# Altium project UltraZohm_ADC.PrjPCB (part 3 of 3)
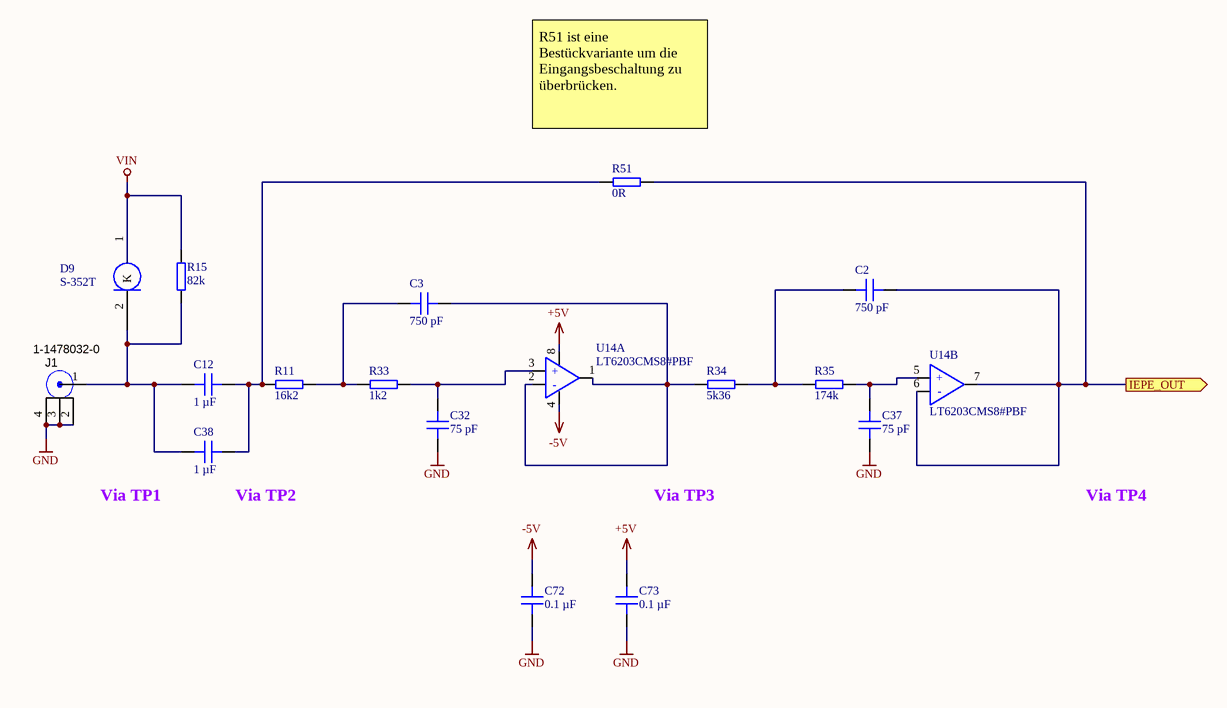
[diagram p10: IEPE.SchDoc]

## Nets that join several sheets
6.5V: Power_3 (L6.1 L8.1 L10.1 L11.1), Power_1 (9 pins)
+1.8V: CarrierConnector (C1.2 U1.2 U1.6), Power_3 (5 pins)
+2.5V: OpAmp1 (R40A.2), OpAmp2 (R40B.2), OpAmp3 (R40C.2), OpAmp4 (R40D.2), ADC1 (C7A.2 U4A.10 U4A.12), ADC2 (C7B.2 U4B.10 U4B.12), ADC3 (C7C.2 U4C.10 U4C.12), ADC4 (C7D.2 U4D.10 U4D.12), Power_3 (C58.2 C59.2 L17.2 R36.2)
+3.3V: OpAmp1 (7 pins), OpAmp2 (7 pins), OpAmp3 (7 pins), OpAmp4 (7 pins), Power_3 (C42.2 C46.2 L9.2 R30.2), I2C (8 pins)
+5V: OpAmp1 (R23A.2), OpAmp2 (R23B.2), OpAmp3 (R23C.2), OpAmp4 (R23D.2), ADC1 (C5A.2 C6A.2 U4A.4), ADC2 (C5B.2 C6B.2 U4B.4), ADC3 (C5C.2 C6C.2 U4C.4), ADC4 (C5D.2 C6D.2 U4D.4), Power_3 (C31.2 C36.2 L7.2 R29.2), IEPE1 (C73A.2 U14A.8), IEPE2 (C73B.2 U14B.8), IEPE3 (C73C.2 U14C.8), IEPE4 (C73D.2 U14D.8)
-5V: Power_2 (5 pins), IEPE1 (C72A.2 U14A.4), IEPE2 (C72B.2 U14B.4), IEPE3 (C72C.2 U14C.4), IEPE4 (C72D.2 U14D.4)
-24V: Power_2 (L4.1 L18.1), Power_1 (14 pins)
GND: CarrierConnector (33 pins), OpAmp1 (15 pins), OpAmp2 (15 pins), OpAmp3 (15 pins), OpAmp4 (15 pins), ADC1 (13 pins), ADC2 (13 pins), ADC3 (13 pins), ADC4 (13 pins), Power_2 (30 pins), Power_3 (34 pins), ADC_Ref (6 pins), I2C (6 pins), Power_1 (23 pins), IEPE1 (7 pins), IEPE2 (7 pins), IEPE3 (7 pins), IEPE4 (7 pins)
VCC: OpAmp1 (R18A.2), OpAmp2 (R18B.2), OpAmp3 (R18C.2), OpAmp4 (R18D.2), Power_2 (C21.2 C22.2 L3.2 TP31.1), ADC_Ref (R31.1)
VCC-: OpAmp1 (R19A.2), OpAmp2 (R19B.2), OpAmp3 (R19C.2), OpAmp4 (R19D.2), Power_2 (C28.2 C29.2 L5.2 TP32.1)
VIN: CarrierConnector (X1.5 X1.6), ADC_Ref (R32.1), Power_1 (L12.1 L13.1 R63.2), IEPE1 (D9A.1 R15A.2), IEPE2 (D9B.1 R15B.2), IEPE3 (D9C.1 R15C.2), IEPE4 (D9D.1 R15D.2)
VREF: ADC1 (L1A.2), ADC2 (L1B.2), ADC3 (L1C.2), ADC4 (L1D.2), ADC_Ref (C70.2 C71.2 TP27.1 U12.6)
ADC_OUT_N1: CarrierConnector (X1.43), ADC1 (U4A.13)
ADC_OUT_N2: CarrierConnector (X1.37), ADC2 (U4B.13)
ADC_OUT_N3: CarrierConnector (X1.31), ADC3 (U4C.13)
ADC_OUT_N4: CarrierConnector (X1.25), ADC4 (U4D.13)
ADC_OUT_P1: CarrierConnector (X1.41), ADC1 (U4A.14)
ADC_OUT_P2: CarrierConnector (X1.35), ADC2 (U4B.14)
ADC_OUT_P3: CarrierConnector (X1.29), ADC3 (U4C.14)
ADC_OUT_P4: CarrierConnector (X1.23), ADC4 (U4D.14)
CLK_N: CarrierConnector (R1.1 R2.1 TP1.1 X1.19), ADC1 (U4A.15), ADC2 (U4B.15), ADC3 (U4C.15), ADC4 (U4D.15)
CLK_P: CarrierConnector (R1.2 R2.2 TP2.1 X1.17), ADC1 (U4A.16), ADC2 (U4B.16), ADC3 (U4C.16), ADC4 (U4D.16)
CVN1: CarrierConnector (R7.2), ADC1 (U4A.9)
CVN2: CarrierConnector (R8.2), ADC2 (U4B.9)
CVN3: CarrierConnector (R9.2), ADC3 (U4C.9)
CVN4: CarrierConnector (R10.2), ADC4 (U4D.9)
EF1: CarrierConnector (X1.42), OpAmp1 (R16A.1 R17A.2)
EF2: CarrierConnector (X1.36), OpAmp2 (R16B.1 R17B.2)
EF3: CarrierConnector (X1.30), OpAmp3 (R16C.1 R17C.2)
EF4: CarrierConnector (X1.24), OpAmp4 (R16D.1 R17D.2)
Gain_01: OpAmp1 (R52A.2 SW2A.8 U13A.7), I2C (U8.8)
Gain_02: OpAmp2 (R52B.2 SW2B.8 U13B.7), I2C (U8.4)
Gain_03: OpAmp3 (R52C.2 SW2C.8 U13C.7), I2C (U8.16)
Gain_04: OpAmp4 (R52D.2 SW2D.8 U13D.7), I2C (U8.20)
Gain_11: OpAmp1 (R55A.2 SW2A.7 U13A.6), I2C (U8.9)
Gain_12: OpAmp2 (R55B.2 SW2B.7 U13B.6), I2C (U8.5)
Gain_13: OpAmp3 (R55C.2 SW2C.7 U13C.6), I2C (U8.15)
Gain_14: OpAmp4 (R55D.2 SW2D.7 U13D.6), I2C (U8.19)
Gain_21: OpAmp1 (R57A.2 SW2A.6 U13A.5), I2C (U8.10)
Gain_22: OpAmp2 (R57B.2 SW2B.6 U13B.5), I2C (U8.6)
Gain_23: OpAmp3 (R57C.2 SW2C.6 U13C.5), I2C (U8.14)
Gain_24: OpAmp4 (R57D.2 SW2D.6 U13D.5), I2C (U8.18)
Gain_31: OpAmp1 (R58A.2 SW2A.5 U13A.4), I2C (U8.11)
Gain_32: OpAmp2 (R58B.2 SW2B.5 U13B.4), I2C (U8.7)
Gain_33: OpAmp3 (R58C.2 SW2C.5 U13C.4), I2C (U8.13)
Gain_34: OpAmp4 (R58D.2 SW2D.5 U13D.4), I2C (U8.17)
IEPE_OUT1: OpAmp1 (U13A.14), IEPE1 (C2A.2 R51A.2 U14A.6 U14A.7)
IEPE_OUT2: OpAmp2 (U13B.14), IEPE2 (C2B.2 R51B.2 U14B.6 U14B.7)
IEPE_OUT3: OpAmp3 (U13C.14), IEPE3 (C2C.2 R51C.2 U14C.6 U14C.7)
IEPE_OUT4: OpAmp4 (U13D.14), IEPE4 (C2D.2 R51D.2 U14D.6 U14D.7)
IN_N1: OpAmp1 (C84A.2 R70A.2), ADC1 (R13A.1)
IN_N2: OpAmp2 (C84B.2 R70B.2), ADC2 (R13B.1)
IN_N3: OpAmp3 (C84C.2 R70C.2), ADC3 (R13C.1)
IN_N4: OpAmp4 (C84D.2 R70D.2), ADC4 (R13D.1)
IN_P1: OpAmp1 (C83A.2 R69A.2), ADC1 (R12A.1)
IN_P2: OpAmp2 (C83B.2 R69B.2), ADC2 (R12B.1)
IN_P3: OpAmp3 (C83C.2 R69C.2), ADC3 (R12C.1)
IN_P4: OpAmp4 (C83D.2 R69D.2), ADC4 (R12D.1)
SCL: CarrierConnector (X1.49), I2C (R38.1 U8.22)
SDA: CarrierConnector (X1.50), I2C (R39.1 U8.23)